# Altium schematic sheet CAN_Transceiver.SchDoc
size A4; SheetNumber: 2; SheetTotal: 3
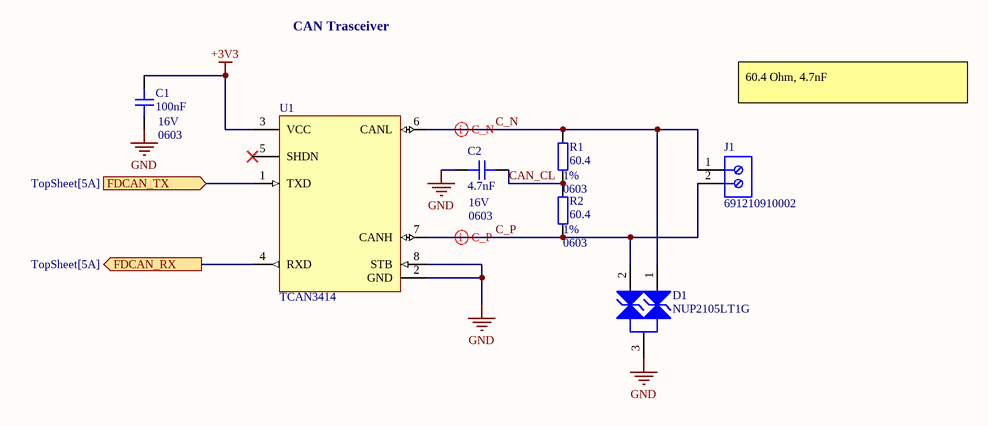
[diagram p0: CAN_Transceiver.SchDoc]

## Parts
C1  value 100nF  Voltage - Rated: 16V  Package / Case: 0603  [0603_C]  (hidden comment: KGM15AR71C104KM)
C2  value 4.7nF  Voltage - Rated: 16V  Package / Case: 0603  [0603_C]  (hidden comment: KGM15AR71C472KT)
D1  NUP2105LT1G  [ONSC-SOT-23-3-318-08_V]
J1  691210910002  [691210910002]
R1  value 60.4  Tolerance: 1%  Package / Case: 0603  [0603_R]  (hidden comment: RC0603FR-0760R4L)
R2  value 60.4  Tolerance: 1%  Package / Case: 0603  [0603_R]  (hidden comment: RC0603FR-0760R4L)
U1  TCAN3414  [SOIC-8NB]

## Ports
FDCAN_RX (out, see TopSheet[5A]), FDCAN_TX (in, see TopSheet[5A])

## Nets
+3V3: C1.2 U1.3(VCC)
GND: C1.1 C2.1 D1.3(K) U1.2(GND) U1.8(STB)
C_N: D1.1(K) J1.1 R1.2 U1.6(CANL)
C_P: D1.2(K) J1.2 R2.1 U1.7(CANH)
CAN_CL: C2.2 R1.1 R2.2
FDCAN_RX: U1.4(RXD) ; port FDCAN_RX
FDCAN_TX: U1.1(TXD) ; port FDCAN_TX

Not connected (* = marked no-connect by the designer): U1 5(SHDN)*

## Layout directives
differential pair; differential pair class C: C_N, C_P

## Notes on the sheet
- CAN Trasceiver
- 60.4 Ohm, 4.7nF

## Library data of the parts
C1 = CMP-001-00851-1: CAP CER 0.1UF 16V X7R 0603; Manufacture: KYOCERA AVX; Tolerance: 10%; Product Status: Active; Mounting Type: Surface Mount, MLCC; Case/Package: Tape & Reel (TR),Cut Tape (CT),Digi-Reel®; Temperature Coefficient: X7R; Applications: General Purpose; Thickness (Max): 0.035" (0.90mm); Manufacture Part Number: KGM15AR71C104KM; Size / Dimension: 0.063" L x 0.032" W (1.60mm x 0.81mm); Operating Temperature: -55°C ~ 125°C; Series: KGM - X7R
C2 = CMP-001-01878-1: CAP CER 4700PF 16V X7R 0603; Manufacture: KYOCERA AVX; Product Status: Active; Tolerance: 10%; Mounting Type: Surface Mount, MLCC; Series: KGM - X7R; Applications: General Purpose; Thickness (Max): 0.035" (0.90mm); Manufacture Part Number: KGM15AR71C472KT; Operating Temperature: -55°C ~ 125°C; Temperature Coefficient: X7R; Case/Package: Tape & Reel (TR),Cut Tape (CT),Digi-Reel®; Size / Dimension: 0.063" L x 0.032" W (1.60mm x 0.81mm)
D1 = CMP-1063-00164-1: Dual Line CAN Bus Protector, 3-Pin SOT-23, Pb-Free, Tape and Reel; Manufacturer: On Semiconductor; IR Max (uA): 0.1; Number of Lines: 2; Direction: Bidirectional; C Max (pF): 30; PPK Max (W): 350; V(BR) Min (V): 26.2; ComponentLink3URL: http://www.onsemi.cn/pub_link/Collateral/318-08.PDF; Mounting Technology: Surface Mount; ComponentLink2Description: Datasheet; PartNumber: NUP2105LT1G; ComponentLink1URL: http://www.onsemi.com/; PackageVersion: Rev. AP, 11/2009; DatasheetVersion: Rev. 5; RoHS: Pb-Free; PackageReference: SOT-23-3-318-08; ComponentLink2URL: http://www.onsemi.cn/pub_link/Collateral/NUP2105L-D.PDF; ComponentLink1Description: Manufacturer URL; PackageDescription: 3-Pin Small Outline Transistor, Body 2.92 x 1.3 mm, Pitch 0.95 mm; Packing: Tape and Reel; ComponentLink3Description: Package Specification
J1 = CMP-1502-02456-2: NexarPartId: 105950649; Current Rating: 6A; Voltage Rating: 150V; Number of Contacts: 2; Number of Rows: 1; Contact Material: Tin; Height: 8.7mm; Max Operating Temperature: 105°C; Min Operating Temperature: -40°C
R1 R2 = CMP-009-00563-1: RES 60.4 OHM 1% 1/10W 0603; Manufacture: YAGEO; Product Status: Active; Power (Watts): 0.1W, 1/10W; Temperature Coefficient: ±100ppm/°C; Size / Dimension: 0.063" L x 0.031" W (1.60mm x 0.80mm); Case/Package: Tape & Reel (TR),Cut Tape (CT),Digi-Reel®; Composition: Thick Film; Manufacture Part Number: RC0603FR-0760R4L; Features: Moisture Resistant; Series: RC_L; Height - Seated (Max): 0.022" (0.55mm); Number of Terminations: 2; Operating Temperature: -55°C ~ 155°C
U1 = TCAN3414: Supplier 1: Mouser; Supplier Part Number 1: 595-TCAN3414DR